# Altium schematic sheet powerAndCommunication.SchDoc
size A4
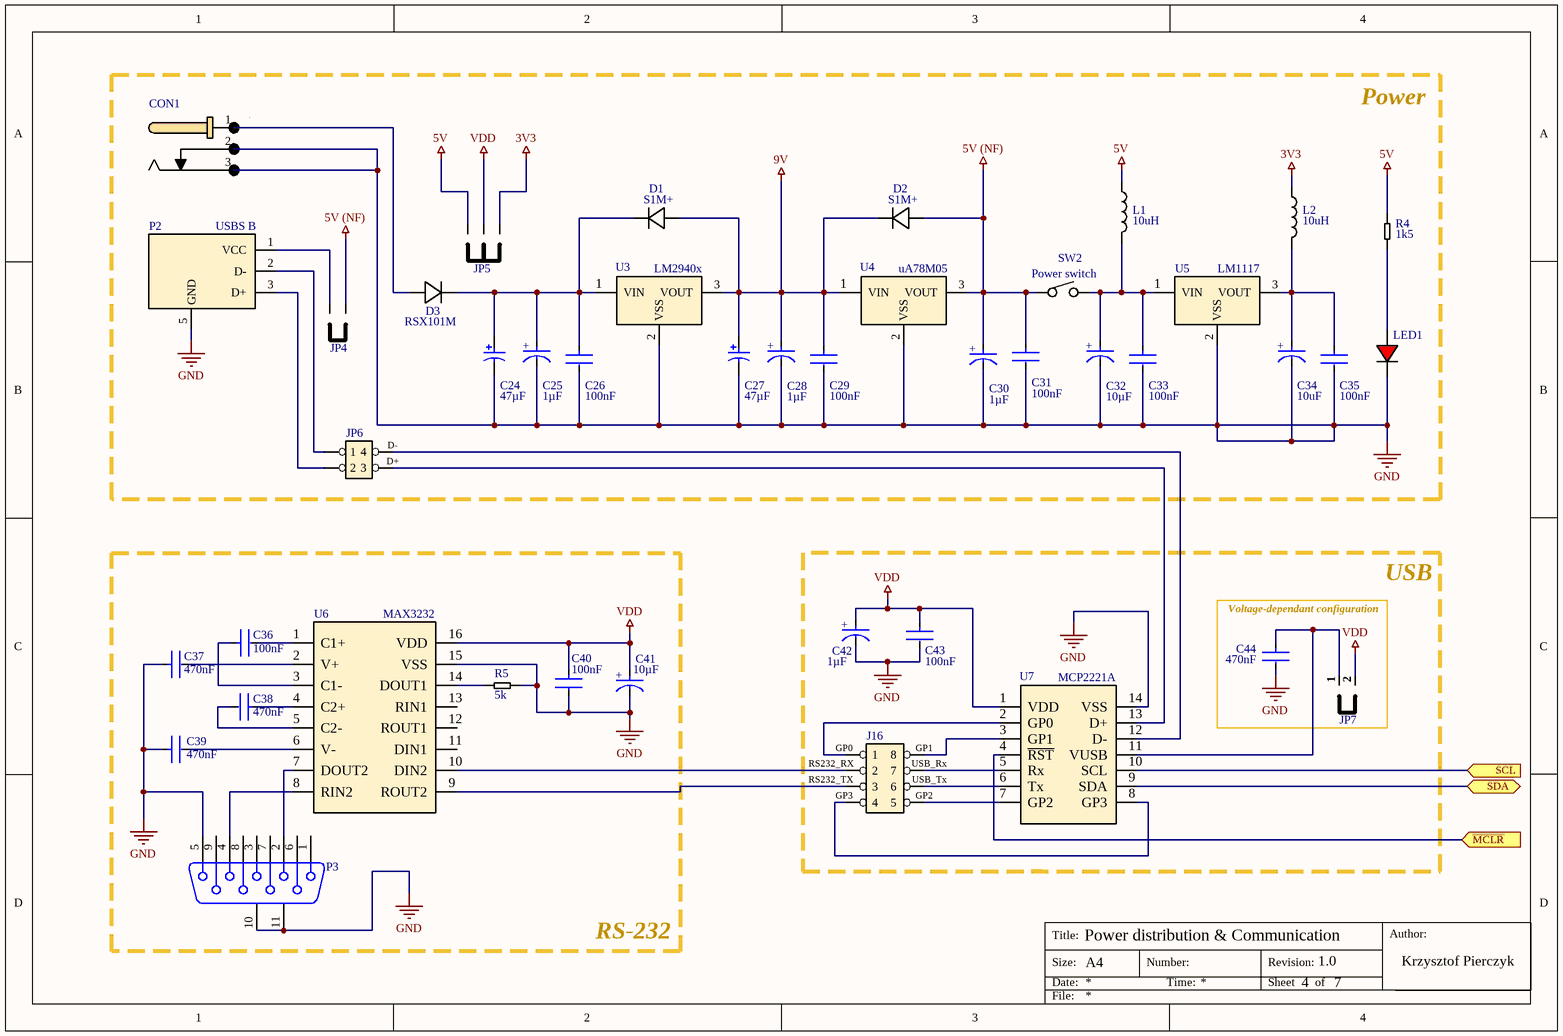
[diagram p0: powerAndCommunication.SchDoc]

## Parts
C24  Capacitance: 47µF  [PNSC-EEE-FK1V331P_L]  (hidden comment: EEE-FK1V331P)
C25  Capacitance: 1µF  [FP-F98S-MFG]  (hidden comment: F981C106MSAAS1)
C26  value 100nF  [FP-C0805C-DN-MFG]  (hidden comment: C0805C102J5GACTU)
C27  Capacitance: 47µF  [PNSC-EEE-FK1V331P_L]  (hidden comment: EEE-FK1V331P)
C28  Capacitance: 1µF  [FP-F98S-MFG]  (hidden comment: F981C106MSAAS1)
C29  value 100nF  [FP-C0805C-DN-MFG]  (hidden comment: C0805C102J5GACTU)
C30  Capacitance: 1µF  [FP-F98S-MFG]  (hidden comment: F981C106MSAAS1)
C31  value 100nF  [FP-C0805C-DN-MFG]  (hidden comment: C0805C102J5GACTU)
C32  Capacitance: 10µF  [FP-F98S-MFG]  (hidden comment: F981C106MSAAS1)
C33  value 100nF  [FP-C0805C-DN-MFG]  (hidden comment: C0805C102J5GACTU)
C34  Capacitance: 10uF  [FP-F98S-MFG]  (hidden comment: F981C106MSAAS1)
C35  value 100nF  [FP-C0805C-DN-MFG]  (hidden comment: C0805C102J5GACTU)
C36  value 100nF  [FP-C0805C-DN-MFG]  (hidden comment: C0805C102J5GACTU)
C37  value 470nF  [FP-C0805C-DN-MFG]  (hidden comment: C0805C102J5GACTU)
C38  value 470nF  [FP-C0805C-DN-MFG]  (hidden comment: C0805C102J5GACTU)
C39  value 470nF  [FP-C0805C-DN-MFG]  (hidden comment: C0805C102J5GACTU)
C40  value 100nF  [FP-C0805C-DN-MFG]  (hidden comment: C0805C102J5GACTU)
C41  Capacitance: 10µF  [FP-F98S-MFG]  (hidden comment: F981C106MSAAS1)
C42  Capacitance: 1µF  [FP-F98S-MFG]  (hidden comment: F981C106MSAAS1)
C43  value 100nF  [FP-C0805C-DN-MFG]  (hidden comment: C0805C102J5GACTU)
C44  value 470nF  [FP-C0805C-DN-MFG]  (hidden comment: C0805C102J5GACTU)
CON1  FC681477  [FC681477]  (value not drawn)
D1  S1M+  [SMA]
D2  S1M+  [SMA]
D3  RSX101M  [SOD-123]
J16  Header 2x4  [Header 2x4]  (value not drawn)
JP4  JUMPER-2  [HDR1X2]  (value not drawn)
JP5  JUMPER-3  [HDR1X3]  (value not drawn)
JP6  Header 2x2  [Header 2x2]  (value not drawn)
JP7  JUMPER-2  [Header 1x2]  (value not drawn)
L1  Inductance: 10uH  [0805]  (hidden comment: NL05JTC100)
L2  Inductance: 10uH  [0805]  (hidden comment: NL05JTC100)
LED1  Red LED  [LED (0805)]  (value not drawn)
P2  USBS B  [USB B (female)]
P3  D Connector 9  [DSUB1.385-2H9]  (value not drawn)
R4  Resistance: 1k5  [0805]  (hidden comment: Resistor)
R5  Resistance: 5k  [0805]  (hidden comment: Resistor)
SW2  Power switch  [Switch 4.7mm (botland)]
U3  LM2940x  [TO-220 (H)]
U4  uA78M05  [TO-220 (H)]
U5  LM1117  [TO-220 (H)]
U6  MAX3232  [SOIC-16 (150mil)]
U7  MCP2221A  [SOIC-14]

## Blocks framed on the sheet
Power: C24-C35 CON1 D1-D3 JP4-JP6 L1 L2 LED1 P2 R4 SW2 U3-U5
RS-232: C36-C41 P3 R5 U6
Voltage-dependant configuration: C42 C43 J16 U7
USB: C44 JP7

## Ports
SCL (in), SDA (bidir), ~{MCLR} (in)

## Nets
3V3: JP5.3 L2.1
5V: JP5.1 L1.1 R4.1
5V (NF): C30.2(A) C31.1 D2.2 JP4.2 SW2.2(COM) U4.3(VOUT)
9V: C27.1 C28.2(A) C29.1 D1.2 D2.1 U3.3(VOUT) U4.1(VIN)
GND: C24.2 C25.1(C) C26.2 C27.2 C28.1(C) C29.2 C30.1(C) C31.2 C32.1(C) C33.2 C34.1(C) C35.2 C37.1 C39.1 C40.2 C41.1(C) C42.1(C) C43.2 C44.2 CON1.2 CON1.3 LED1.2 P2.5(GND) P3.5 P3.10(MH1) P3.11(MH2) R5.2 U3.2(VSS) U4.2(VSS) U5.2(VSS) U6.15(VSS) U7.14(VSS)
VDD: C40.1 C41.2(A) C42.2(A) C43.1 JP5.2 JP7.2 U6.16(VDD) U7.1(VDD)
D+: JP6.3 U7.13(D+)
D-: JP6.4 U7.12(D-)
GP0: J16.1 U7.2(GP0)
GP1: J16.8 U7.3(GP1)
GP2: J16.5 U7.7(GP2)
GP3: J16.4 U7.8(GP3)
~{MCLR}: U7.4(~{RST}) ; port ~{MCLR}
RS232_RX: J16.2 U6.10(DIN2)
RS232_TX: J16.3 U6.9(ROUT2)
SCL: U7.10(SCL) ; port SCL
SDA: U7.9(SDA) ; port SDA
USB_Rx: J16.7 U7.5(Rx)
USB_Tx: J16.6 U7.6(Tx)
NetC24_1: C24.1 C25.2(A) C26.1 D1.1 D3.2 U3.1(VIN)
NetC32_2: C32.2(A) C33.1 L1.2 SW2.1 U5.1(VIN)
NetC34_2: C34.2(A) C35.1 L2.2 U5.3(VOUT)
NetC36_1: C36.1 U6.3(C1-)
NetC36_2: C36.2 U6.1(C1+)
NetC37_2: C37.2 U6.2(V+)
NetC38_1: C38.1 U6.4(C2+)
NetC38_2: C38.2 U6.5(C2-)
NetC39_2: C39.2 U6.6(V-)
NetC44_1: C44.1 JP7.1 U7.11(VUSB)
NetCON1_1: CON1.1 D3.1
NetJP4_1: JP4.1 P2.1(VCC)
NetJP6_1: JP6.1 P2.2(D-)
NetJP6_2: JP6.2 P2.3(D+)
NetLED1_1: LED1.1 R4.2
NetP3_2: P3.2 U6.7(DOUT2)
NetP3_4: P3.4 U6.8(RIN2)
NetR5_1: R5.1 U6.14(DOUT1)

Not connected (* = marked no-connect by the designer): P3 1 3 6 7 8 9; U6 11(DIN1) 12(ROUT1) 13(RIN1)

## Notes on the sheet
- Power distribution & Communication
- 4
- 1.0
- 7
- Title:
- Size:
- Date:
- A4
- Number:
- Time:
- Revision:
- Sheet
- of
- Author:
- Krzysztof Pierczyk
- File:
- (in symbol CMP-04424-000018-1) +

## Library data of the parts
C24 C27 = CMP-2000-06212-1: Aluminum Electrolytic Capacitor, 330 uF, 35 V, -55 to 105 degC, 2-Pin CAPAE, RoHS, Tape and Reel; Manufacturer: Panasonic; Type: Can; Impedance: 0.08O; Ripple Current: 850mA; Lifetime@Temperature: 2000Hrs@105°C; Rated Voltage: 35V; Datasheet Version: 07/2008; Manufacturer URL: http://www.panasonic.com/; Package Description: 2-Pin Capacitor Aluminum Electrolytic, Body 10.3 x 10.3 mm, Height 10.5 mm; Case Size/Dimension: Ø10x10.2mm; Datasheet URL: https://datasheet.ciiva.com/29313/443481-da-01-en-smd-elko-vfk-g-330-uf-35v-29313592.pdf; Series: FK; Mounting Technology: SurfaceMount; Package Reference: EEE-FK1V331P; Operating Temp-Max: 105°C; Operating Temp Range: -55to+105°C
C25 C28 C30 C32 C34 C41 C42 = CMP-04424-000018-1: CAP TANT 10UF 20% 16V 0805; Manufacturer: AVX; Esr: 4.5Ω; Material: Tantalum; Ripple Current: 100mA; Leakage Current: 1.6uA; Life: 1000Hours; Dissipation Factor: 18%; Temperature Range High: +125°C; Temperature: -55°C to +125°C; Digikey Description: CAP TANT 10UF 20% 16V 0805; Tolerance: 20%; Automotive: No; Voltage Rating: 16V; Device Class L3: Tantalum Capacitors; Package: F98S; Device Class L2: Capacitors; Footprint Url: https://www.avx.com/download/software/literature/AVX-Footprint-Library.pdf; Mouser Description: Cap Tant Solid 10uF 16V S CASE 20% (2 x 1.25 x 0.8mm) SMD 2012-09 4.5Ohm 125°C T/R; Value: 10uF; ComponentLink2URL: http://datasheets.avx.com/F98-AS1.pdf; Height: 0.9mm; Manufacturer Part Number: F981C106MSAAS1; ComponentLink2Description: Datasheet; Lead Free: Yes; Category: Cap; Temperature Coefficient: 20%; RoHS: TRUE; Temperature Range Low: -55°C; Octopart: https://octopart.com/f981c106msaas1-avx-49645945; Device Class L1: Passive Components
C26 C29 C31 C33 C35-C40 C43 C44 = CMP-03020-008364-1: CAP CER 1000PF 50V C0G/NP0 0805; Manufacturer: KEMET; Capacitance: 1,000 pF; Temperature Characteristic: C0G; Material: Ceramic; Temperature Coefficient: 30ppm/°C; Tolerance: 0.05; Automotive: No; Voltage Rating: 50 V; Device Class L1: Passive Components; Digikey Description: CAP CER 1000PF 50V C0G/NP0 0805; Lead Free: Yes; Package: C0805C-DN; RoHS: TRUE; Temperature Range High: +125°C; Height: 0.88mm; Ipc Land Pattern Name: CAPC200125X78; Category: Cap; ComponentLink2URL: https://content.kemet.com/datasheets/KEM_C1003_C0G_SMD.pdf; Device Class L2: Capacitors; ComponentLink2Description: Datasheet; Temperature: -55°C to +125°C; Octopart: https://octopart.com/c0805c102j5gactu-kemet-97757; Mouser Description: Multilayer Ceramic Capacitors MLCC - SMD/SMT 50volts 1000pF C0G 5%; Manufacturer Part Number: C0805C102J5GACTU; Device Class L3: Ceramic Capacitors; Temperature Range Low: -55°C
CON1 = DC Jack: Rating: 12V / 2A; ComponentLink1Description: Datasheet; ComponentLink1URL: http://www.farnell.com/datasheets/2607082.pdf?_ga=2.241941314.1193962280.1589558354-303286379.1586364067&_gac=1.189249881.1589563198.Cj0KCQjw-_j1BRDkARIsAJcfmTFIG7O-lBwUzM7jXL1d54rcmK8ZCJrBZphKUIU-ia_1DnqilNgsh1YaAq1qEALw_wcB
D1 D2 = S1M+_1: V_reverse (max): 1000V; I_forward (max): 1A; V_forward (max): 1.1V; ComponentLink1Description: Datasheet; ComponentLink1URL: http://www.farnell.com/datasheets/2863963.pdf?_ga=2.217691222.1193962280.1589558354-303286379.1586364067&_gac=1.191757912.1589563198.Cj0KCQjw-_j1BRDkARIsAJcfmTFIG7O-lBwUzM7jXL1d54rcmK8ZCJrBZphKUIU-ia_1DnqilNgsh1YaAq1qEALw_wcB
D3 = RSX101M-30TR: Vf (max): 350mV; If (max): 1A
L1 L2 = Coil: SMD coil; Tolerance: +/- 20%; Impedance (DCR): 100mohm; Rated current: 1.44A; ComponentLink1Description: Datasheet; ComponentLink1URL: https://www.piekarz.pl/pdf.php?id=28071
LED1 = Red LED: Nominal current: 2mA; Nominal voltage: 1.95V; ComponentLink1Description: Datasheet; ComponentLink1URL: http://www.farnell.com/datasheets/2863963.pdf?_ga=2.217691222.1193962280.1589558354-303286379.1586364067&_gac=1.191757912.1589563198.Cj0KCQjw-_j1BRDkARIsAJcfmTFIG7O-lBwUzM7jXL1d54rcmK8ZCJrBZphKUIU-ia_1DnqilNgsh1YaAq1qEALw_wcB
P2 = LUMBERG241103: ComponentLink1Description: Datasheet; ComponentLink1URL: http://www.farnell.com/datasheets/2632919.pdf?_ga=2.217691222.1193962280.1589558354-303286379.1586364067&_gac=1.191757912.1589563198.Cj0KCQjw-_j1BRDkARIsAJcfmTFIG7O-lBwUzM7jXL1d54rcmK8ZCJrBZphKUIU-ia_1DnqilNgsh1YaAq1qEALw_wcB
P3 = D Connector 9: Receptacle Assembly, 9 Position, Right Angle; PackageDocument: O; Positions: 9; Published: 15-Jun-2001; LatestRevisionDate: 17-Jul-2002; LatestRevisionNote: Re-released for DXP Platform.; DatasheetDocument: 1-Sep-1999; PackageReference: 788750; Publisher: Altium Limited; Orientation: Right Angle; Gender: Receptacle
R4 R5 = Resistor: Nominal power: 125mW
SW2 = Double switch
U3 = LM2940x: VIN (min): 10.5V; VIN (max): 26V; VOUT: 9V; IOUT (max): 1A; I_Quiescent (max): 20mA; ComponentLink1Description: Datasheet; ComponentLink1URL: http://www.ti.com/lit/ds/symlink/lm2940-n.pdf?&ts=1589639085194
U4 = uA78M05: VIN (min): 7V; VIN (max): 25V; VOUT: 5V; IOUT (max): 500mA; I_Quiescent (max): 6mA; ComponentLink1Description: Datasheet; ComponentLink1URL: http://www.ti.com/lit/ds/symlink/ua78m.pdf?&ts=1589638247503
U5 = LM1117: VIN (min): 4.75V; VIN (max): 15V; VOUT: 3.3V; IOUT (max): 800mA; I_Quiescent (max): 10mA; ComponentLink1Description: Datasheet; ComponentLink1URL: http://www.ti.com/lit/ds/symlink/ua78m.pdf?&ts=1589638247503
U6 = MAX3232: VDD (min): 3V; VDD (max): 5.5V; IDD: 1mA; ComponentLink1Description: Datasheet; ComponentLink1URL: http://www.ti.com/lit/ds/symlink/max3232.pdf?&ts=1589636660726
U7 = MCP2221A: VDD (min): 3.0V; VDD (max): 5.5V; ICC (max): 15mA; ComponentLink1Description: Datasheet; ComponentLink1URL: http://ww1.microchip.com/downloads/en/devicedoc/20005565b.pdf